# EAGLE schematic LoraGateway (EAGLE 9.2.2)

## Sheet 1 of 4: Power Supplies
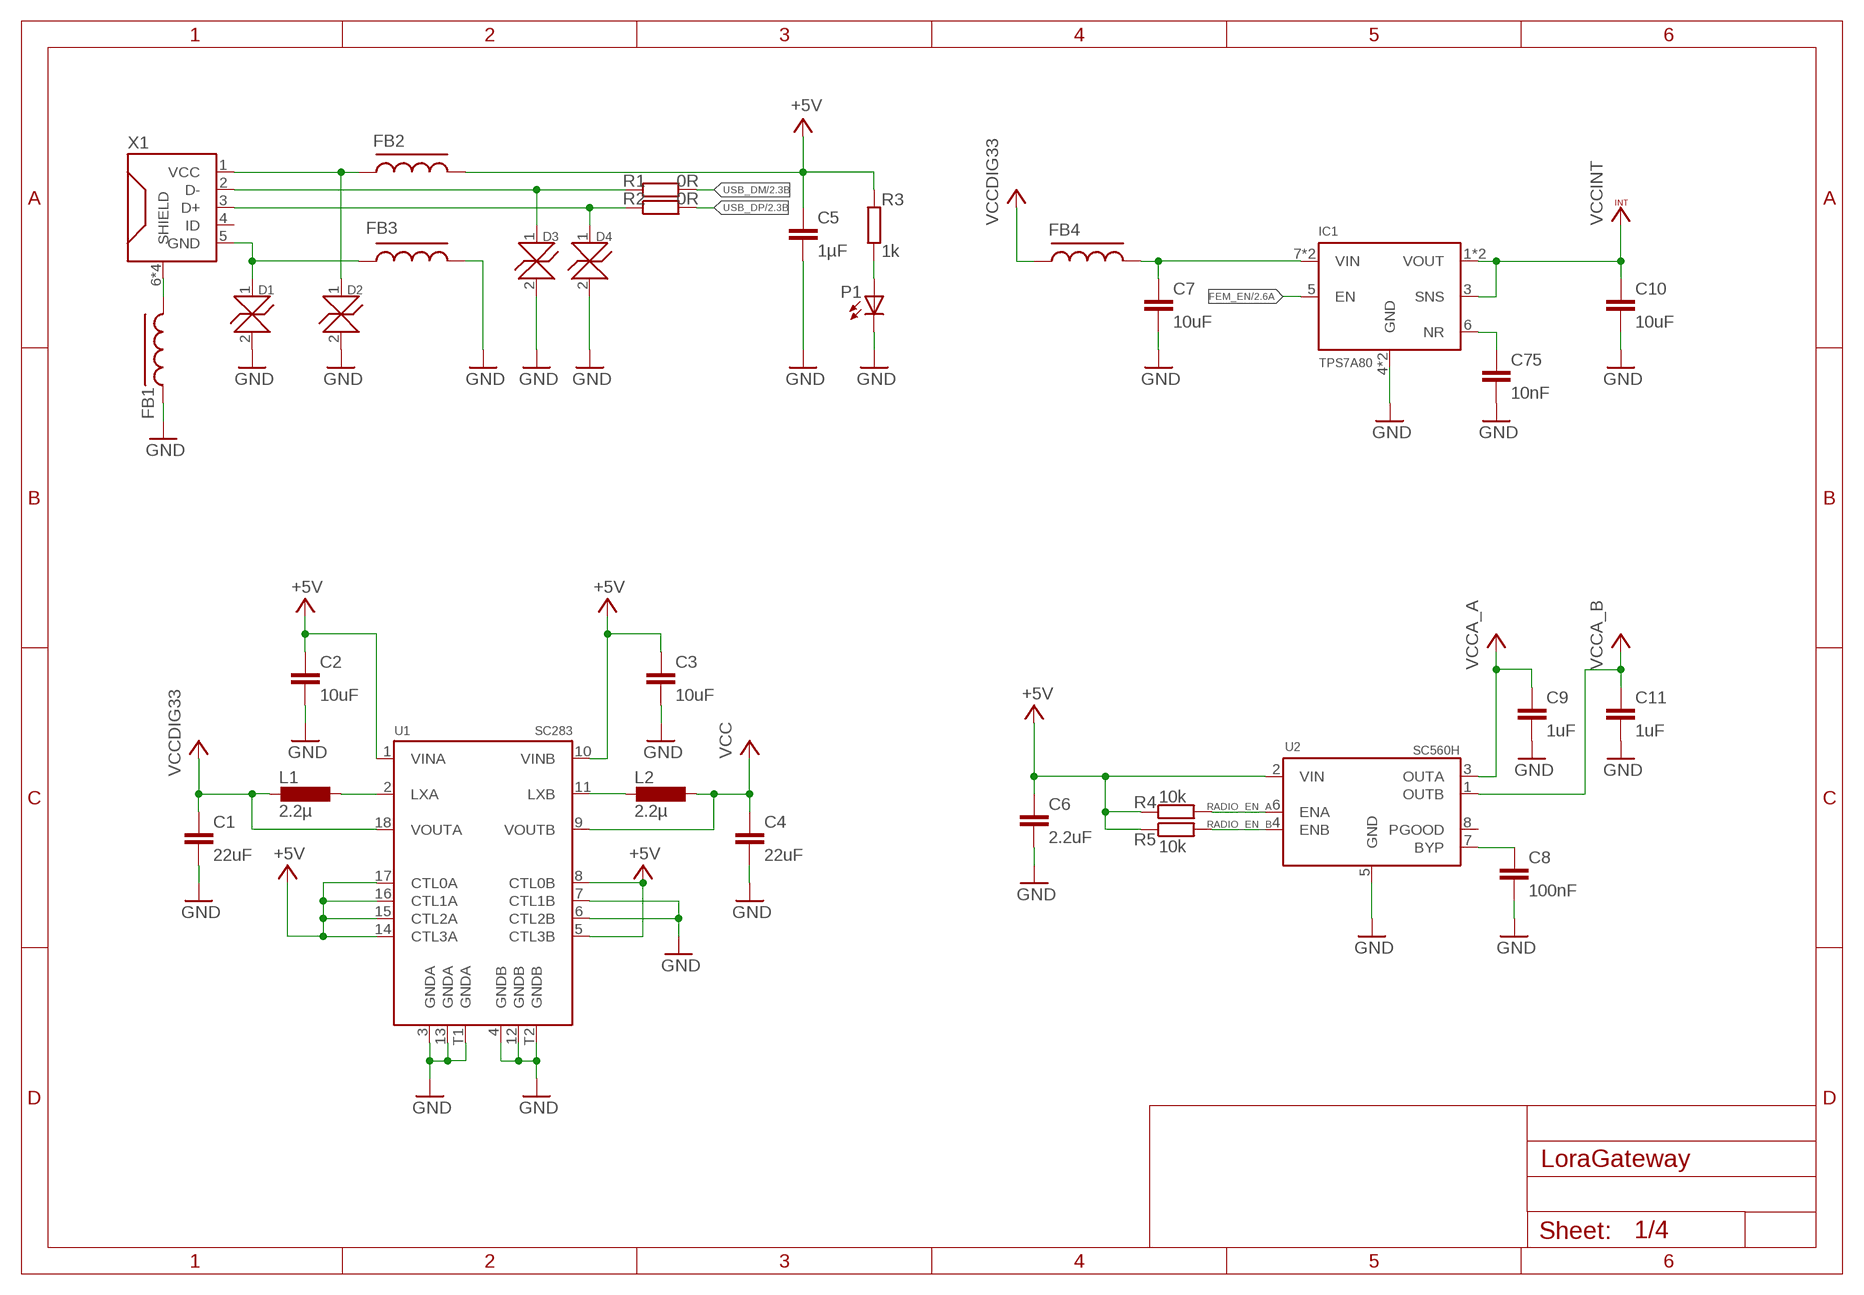
[diagram p0: schematic, sheet 1]

### Parts
C1  22uF  C-EUC1206  [C1206]
C2  10uF  C-EUC1206  [C1206]
C3  10uF  C-EUC1206  [C1206]
C4  22uF  C-EUC1206  [C1206]
C5  1µF  C-EUC0805  [C0805]
C6  2.2uF  C-EUC0603  [C0603]
C7  10uF  C-EUC0805  [C0805]
C8  100nF  C-EUC0402  [C0402]
C9  1uF  C-EUC0805  [C0805]
C10  10uF  C-EUC0805  [C0805]
C11  1uF  C-EUC0805  [C0805]
C75  10nF  C-EUC0402  [C0402]
D1  RCLAMP0531T  [SLP1006P2T]
D2  RCLAMP0531T  [SLP1006P2T]
D3  RCLAMP0531T  [SLP1006P2T]
D4  RCLAMP0531T  [SLP1006P2T]
FB1  BLM15PG100SN1D0402  [L0402]
FB2  BLM15PG100SN1D0402  [L0402]
FB3  BLM15PG100SN1D0402  [L0402]
FB4  BLM15PG100SN1D0402  [L0402]
IC1  TPS7A80  [SON-8]
L1  2.2µ  ASPI-0418  [ASPI-0418]
L2  2.2µ  ASPI-0418  [ASPI-0418]
P1  LTST-C191KGKT  [LED_SML0603]
R1  0R  R-EU_R0402  [R0402]
R2  0R  R-EU_R0402  [R0402]
R3  1k  R-EU_R0402  [R0402]
R4  10k  R-EU_R0402  [R0402]
R5  10k  R-EU_R0402  [R0402]
U1  SC283  [2X3MLPQ-W18]
U2  SC560H  [MLPQ-UT8]
X1  USB2-MICRO  [USB-2-MICRO]

### Nets
+5V: C2.1 C3.1 C5.2 C6.1 FB2.2 R3.2 R4.1 R5.1 U1.1(VINA) U1.5(CTL3B) U1.8(CTL0B) U1.10(VINB) U1.14(CTL3A) U1.15(CTL2A) U1.16(CTL1A) U1.17(CTL0A) U2.2(VIN) ; also sheet 2
D+: D4.1 R2.1 X1.3(D+)
D-: D3.1 R1.1 X1.2(D-)
FEM_EN: IC1.5(EN) ; also sheet 2,4
GND: C1.2 C2.2 C3.2 C4.2 C5.1 C6.2 C7.2 C8.2 C9.2 C10.2 C11.2 C75.2 D1.2 D2.2 D3.2 D4.2 FB1.1 FB3.2 IC1.4(GND) IC1.EXP(GND) P1.C U1.3(GNDA) U1.4(GNDB) U1.6(CTL2B) U1.7(CTL1B) U1.12(GNDB) U1.13(GNDA) U1.T1(GNDA) U1.T2(GNDB) U2.5(GND) ; also sheet 2,3,4
N$1: L1.1 U1.2(LXA)
N$2: L2.2 U1.11(LXB)
N$3: C75.1 IC1.6(NR)
N$4: C8.1 U2.7(BYP)
N$6: D1.1 FB3.1 X1.5(GND)
N$9: FB1.2 X1.6(SHIELD) X1.7(SHIELD) X1.8(SHIELD) X1.9(SHIELD)
N$10: P1.A R3.1
N$12: C7.1 FB4.2 IC1.7(VIN) IC1.8(VIN)
RADIO_EN_A: R4.2 U2.6(ENA) ; also sheet 2
RADIO_EN_B: R5.2 U2.4(ENB) ; also sheet 2
USB_DM: R1.2 ; also sheet 2
USB_DP: R2.2 ; also sheet 2
VBUS: D2.1 FB2.1 X1.1(VCC)
VCC: C4.1 L2.1 U1.9(VOUTB) ; also sheet 3
VCCA_A: C9.1 U2.3(OUTA) ; also sheet 4
VCCA_B: C11.1 U2.1(OUTB) ; also sheet 4
VCCDIG33: C1.1 FB4.1 L1.2 U1.18(VOUTA) ; also sheet 2,3
VCCINT: C10.1 IC1.1(VOUT) IC1.2(VOUT) IC1.3(SNS) ; also sheet 4
Unconnected: U2.8(PGOOD) X1.4(ID)

## Sheet 2 of 4: Microcontroller
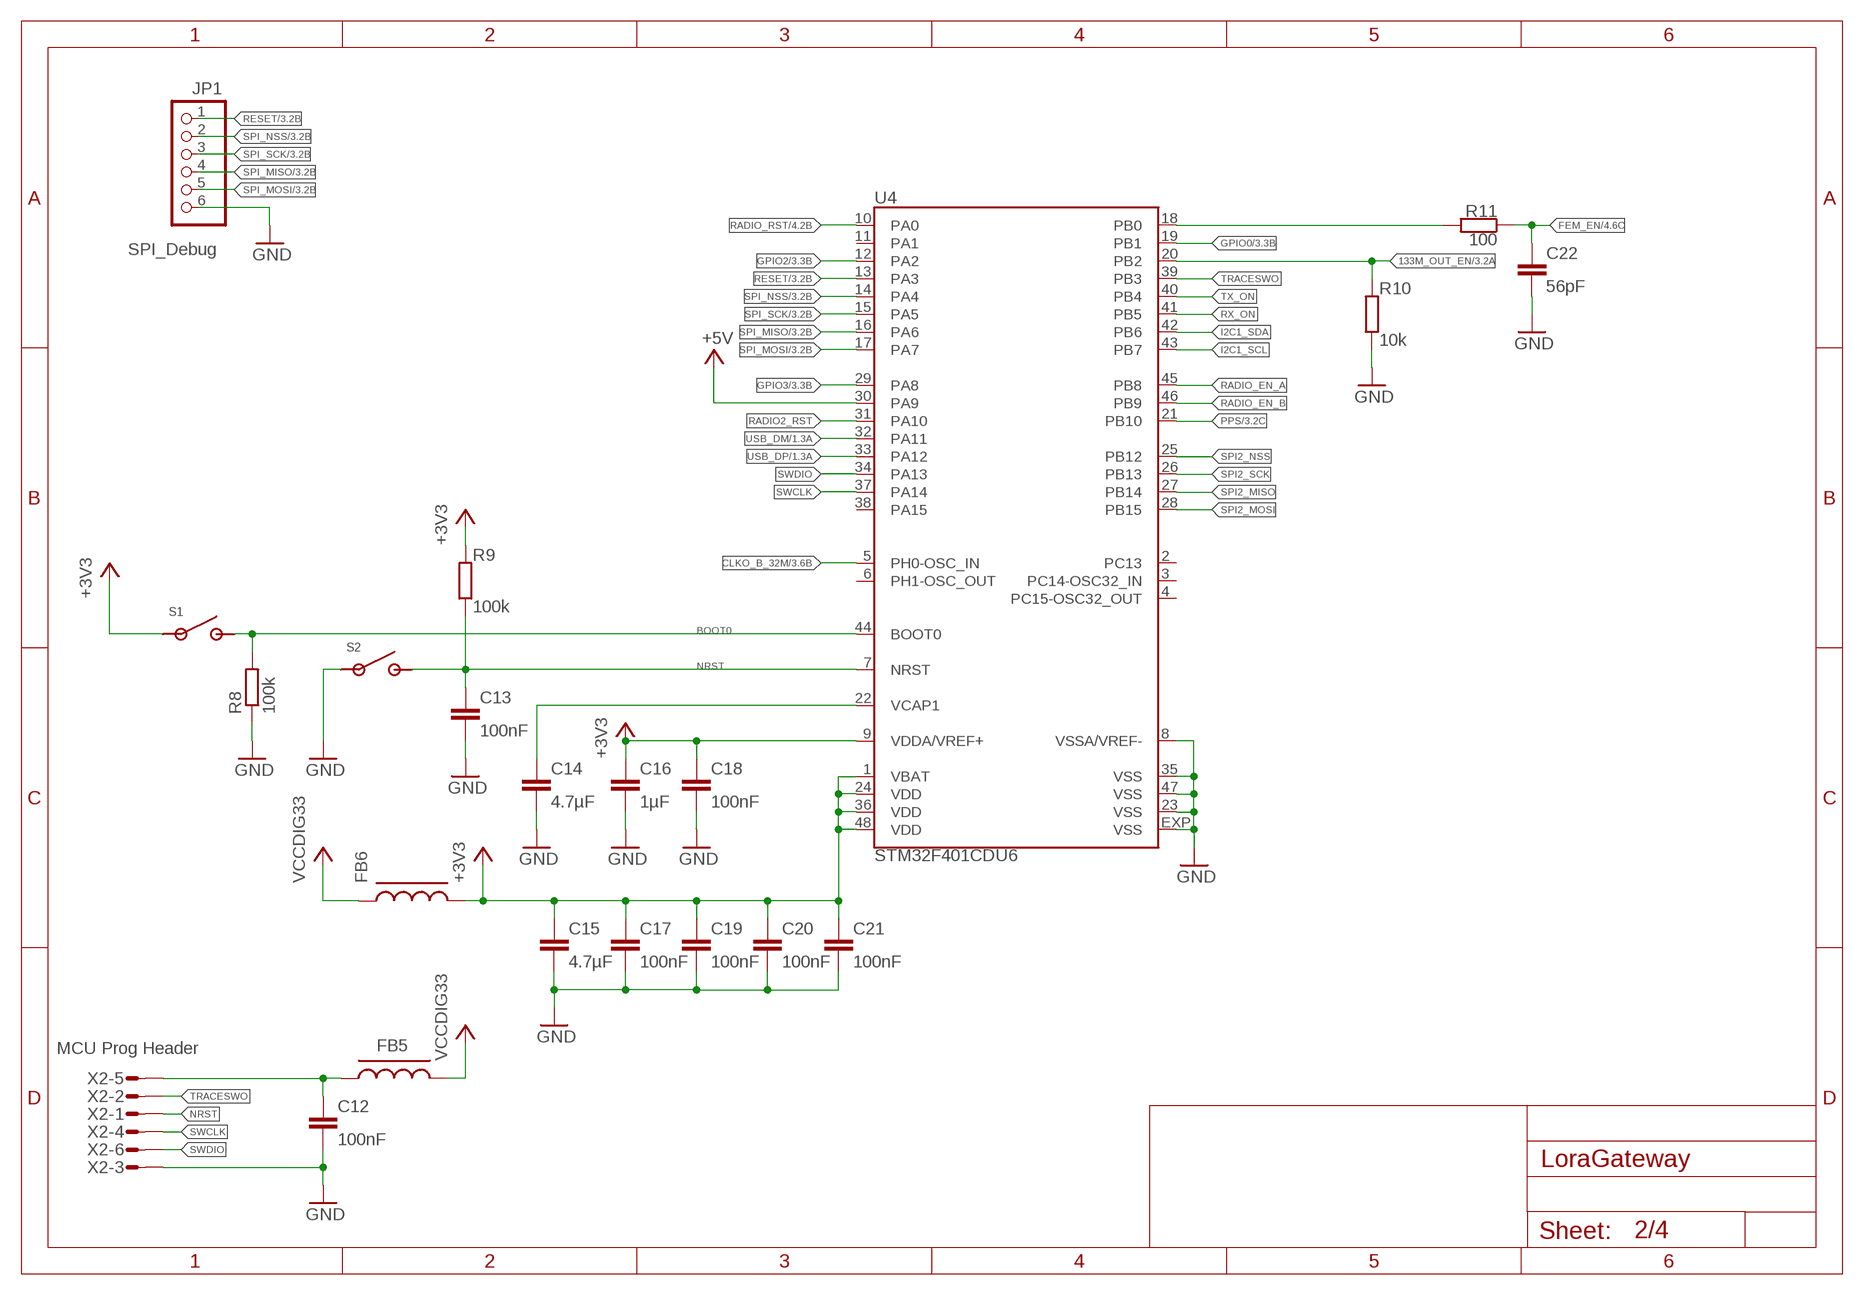
[diagram p1: schematic, sheet 2]

### Parts
C12  100nF  C-EUC0402  [C0402]
C13  100nF  C-EUC0402  [C0402]
C14  4.7µF  C-EUC0603  [C0603]
C15  4.7µF  C-EUC0603  [C0603]
C16  1µF  C-EUC0402  [C0402]
C17  100nF  C-EUC0402  [C0402]
C18  100nF  C-EUC0402  [C0402]
C19  100nF  C-EUC0402  [C0402]
C20  100nF  C-EUC0402  [C0402]
C21  100nF  C-EUC0402  [C0402]
C22  56pF  C-EUC0402  [C0402]
FB5  BLM15PG100SN1D0402  [L0402]
FB6  BLM15PG100SN1D0402  [L0402]
JP1  SPI_Debug  PINHD-1X6  [1X06]
R8  100k  R-EU_R0402  [R0402]
R9  100k  R-EU_R0402  [R0402]
R10  10k  R-EU_R0402  [R0402]
R11  100  R-EU_R0402  [R0402]
S1  KXT121LHS  [SMDSWITCH3.5X2.0MM]
S2  KXT121LHS  [SMDSWITCH3.5X2.0MM]
U4  STM32F401CDU6  [P-QFP48-7X7MM]
X2  MCU Prog Header  MICROMATCH-6  [MICROMATCH-6]

### Nets
133M_OUT_EN: R10.2 U4.20(PB2) ; also sheet 3
+3V3: C15.1 C16.1 C17.1 C18.1 C19.1 C20.1 C21.1 FB6.2 R9.2 S1.P$1 U4.1(VBAT) U4.9(VDDA/VREF+) U4.24(VDD) U4.36(VDD) U4.48(VDD)
+5V: U4.30(PA9) ; also sheet 1
BOOT0: R8.2 S1.P$2 U4.44(BOOT0)
CLKO_B_32M: U4.5(PH0-OSC_IN) ; also sheet 3
FEM_EN: C22.1 R11.1 ; also sheet 1,4
GND: C12.2 C13.2 C14.2 C15.2 C16.2 C17.2 C18.2 C19.2 C20.2 C21.2 C22.2 JP1.6 R8.1 R10.1 S2.P$1 U4.8(VSSA/VREF-) U4.23(VSS) U4.35(VSS) U4.47(VSS) U4.EXP(VSS) X2.3 ; also sheet 1,3,4
GPIO0: U4.19(PB1) ; also sheet 3
GPIO2: U4.12(PA2) ; also sheet 3
GPIO3: U4.29(PA8) ; also sheet 3
I2C1_SCL: U4.43(PB7)
I2C1_SDA: U4.42(PB6)
N$5: C12.1 FB5.1 X2.5
N$33: R11.2 U4.18(PB0)
NRST: C13.1 R9.1 S2.P$2 U4.7(NRST) X2.1
PPS: U4.21(PB10) ; also sheet 3
RADIO2_RST: U4.31(PA10)
RADIO_EN_A: U4.45(PB8) ; also sheet 1
RADIO_EN_B: U4.46(PB9) ; also sheet 1
RADIO_RST: U4.10(PA0) ; also sheet 4
RESET: JP1.1 U4.13(PA3) ; also sheet 3
RX_ON: U4.41(PB5) ; also sheet 3
SPI2_MISO: U4.27(PB14)
SPI2_MOSI: U4.28(PB15)
SPI2_NSS: U4.25(PB12)
SPI2_SCK: U4.26(PB13)
SPI_MISO: JP1.4 U4.16(PA6) ; also sheet 3
SPI_MOSI: JP1.5 U4.17(PA7) ; also sheet 3
SPI_NSS: JP1.2 U4.14(PA4) ; also sheet 3
SPI_SCK: JP1.3 U4.15(PA5) ; also sheet 3
SWCLK: U4.37(PA14) X2.4
SWDIO: U4.34(PA13) X2.6
TRACESWO: U4.39(PB3) X2.2
TX_ON: U4.40(PB4) ; also sheet 3
USB_DM: U4.32(PA11) ; also sheet 1
USB_DP: U4.33(PA12) ; also sheet 1
VCAP: C14.1 U4.22(VCAP1)
VCCDIG33: FB5.2 FB6.1 ; also sheet 1,3
Unconnected: U4.2(PC13) U4.3(PC14-OSC32_IN) U4.4(PC15-OSC32_OUT) U4.6(PH1-OSC_OUT) U4.11(PA1) U4.38(PA15)

## Sheet 3 of 4: Baseband
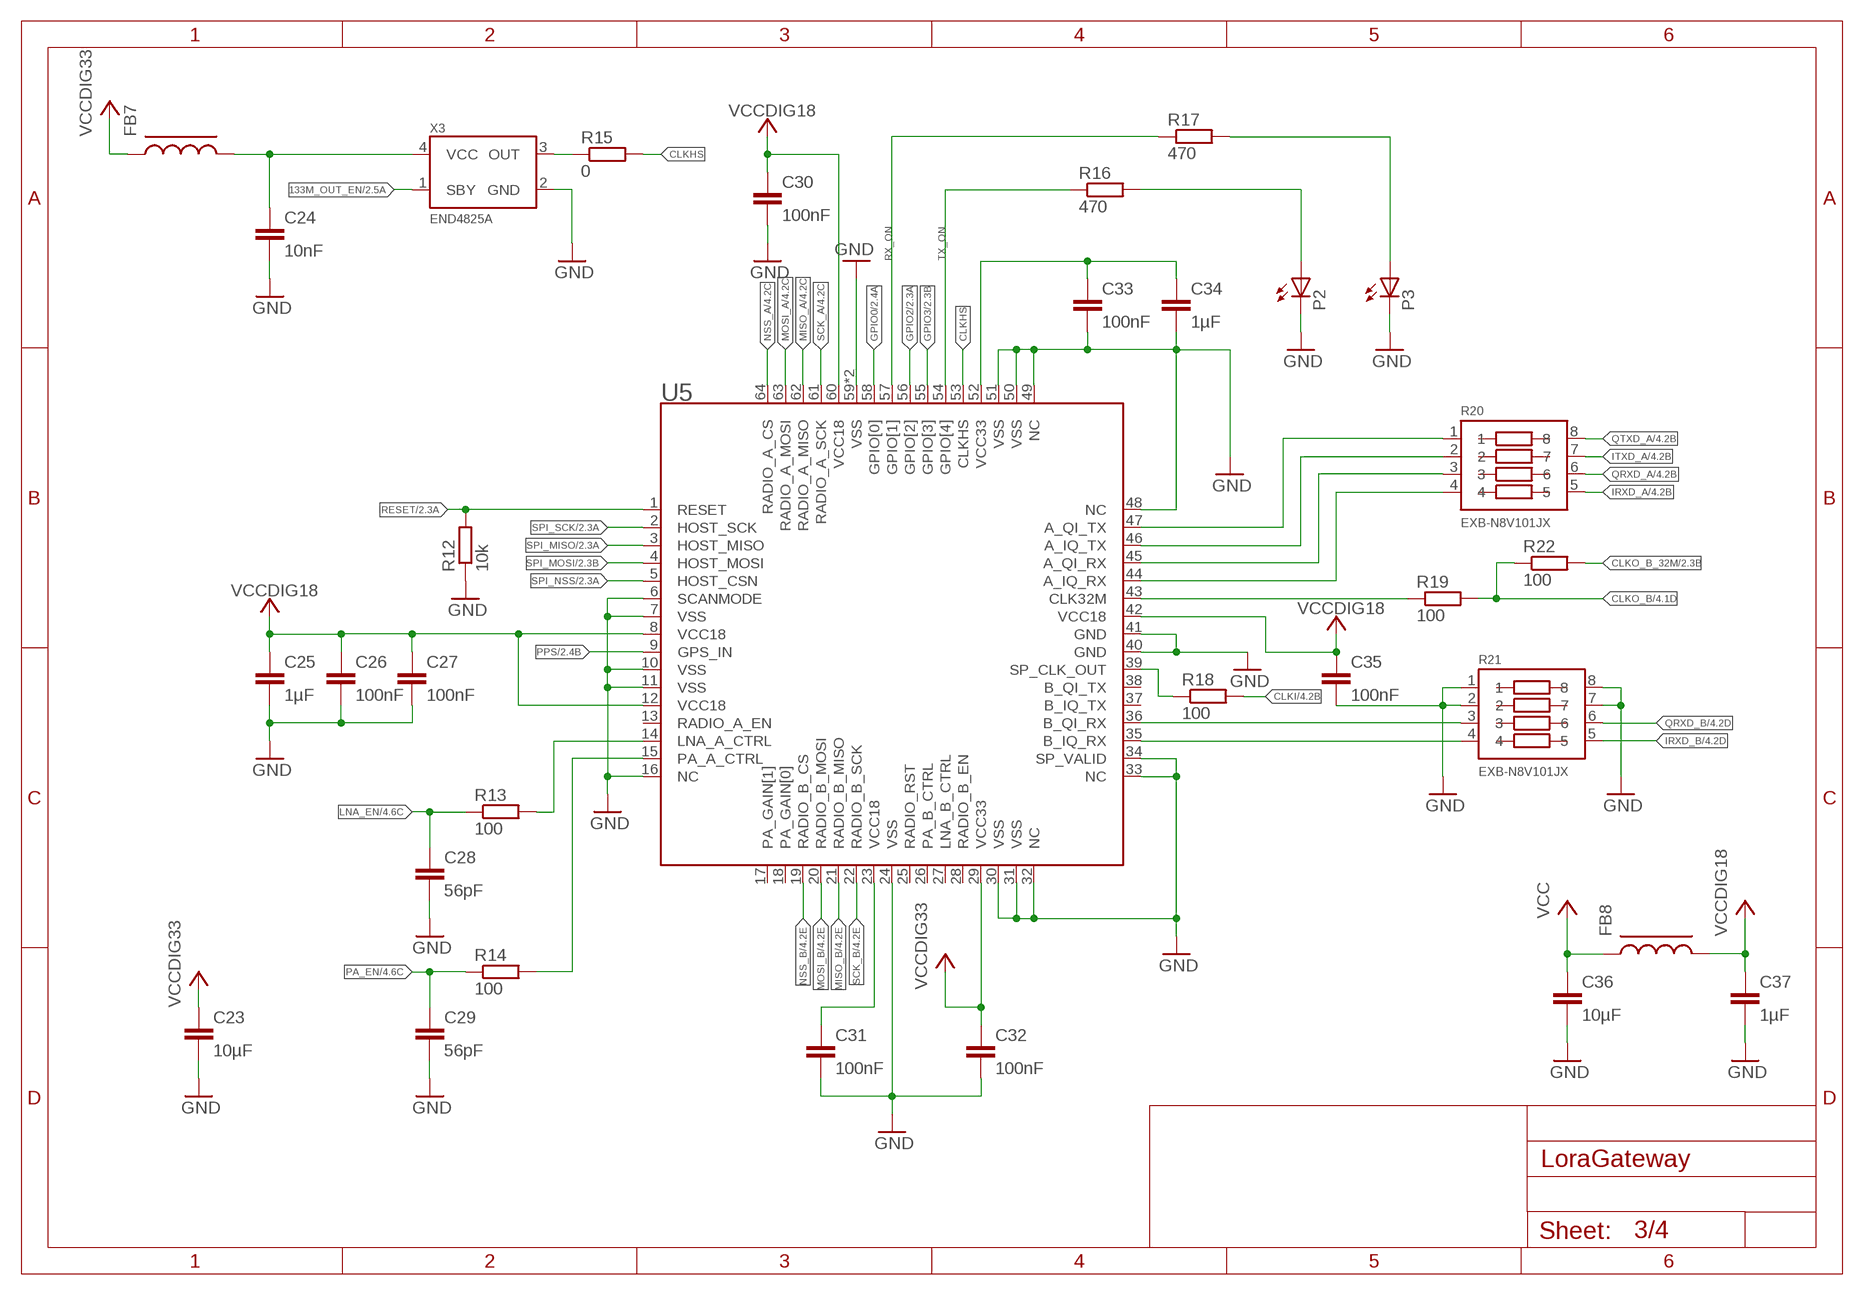
[diagram p2: schematic, sheet 3]

### Parts
C23  10µF  C-EUC0805  [C0805]
C24  10nF  C-EUC0402  [C0402]
C25  1µF  C-EUC0603  [C0603]
C26  100nF  C-EUC0402  [C0402]
C27  100nF  C-EUC0402  [C0402]
C28  56pF  C-EUC0402  [C0402]
C29  56pF  C-EUC0402  [C0402]
C30  100nF  C-EUC0402  [C0402]
C31  100nF  C-EUC0402  [C0402]
C32  100nF  C-EUC0402  [C0402]
C33  100nF  C-EUC0402  [C0402]
C34  1µF  C-EUC0603  [C0603]
C35  100nF  C-EUC0402  [C0402]
C36  10µF  C-EUC0805  [C0805]
C37  1µF  C-EUC0603  [C0603]
FB7  BLM15PG100SN1D0402  [L0402]
FB8  BLM15PG100SN1D0402  [L0402]
P2  LTST-C930KGKT  [LTST-C930KGKT]
P3  LTST-C930KGKT  [LTST-C930KGKT]
R12  10k  R-EU_R0402  [R0402]
R13  100  R-EU_R0402  [R0402]
R14  100  R-EU_R0402  [R0402]
R15  0  R-EU_R0402  [R0402]
R16  470  R-EU_R0402  [R0402]
R17  470  R-EU_R0402  [R0402]
R18  100  R-EU_R0402  [R0402]
R19  100  R-EU_R0402  [R0402]
R20  EXB-N8V101JX  [EXB28V]
R21  EXB-N8V101JX  [EXB28V]
R22  100  R-EU_R0402  [R0402]
U5  SX1308  [QFN64-9X9]
X3  END4825A  [2.5X2.0MM]

### Nets
133M_OUT_EN: X3.1(SBY) ; also sheet 2
CLKHS: R15.2 U5.53(CLKHS)
CLKI: R18.2 ; also sheet 4
CLKO_B: R19.2 R22.1 ; also sheet 4
CLKO_B_32M: R22.2 ; also sheet 2
GND: C23.2 C24.2 C25.2 C26.2 C27.2 C28.2 C29.2 C30.2 C31.2 C32.2 C33.2 C34.2 C35.2 C36.2 C37.2 P2.2(C) P3.2(C) R12.1 R21.1 R21.2 R21.7 R21.8 U5.6(SCANMODE) U5.7(VSS) U5.10(VSS) U5.11(VSS) U5.16(NC) U5.24(VSS) U5.30(VSS) U5.31(VSS) U5.32(NC) U5.33(NC) U5.34(SP_VALID) U5.40(GND) U5.41(GND) U5.48(NC) U5.49(NC) U5.50(VSS) U5.51(VSS) U5.59(VSS) U5.EXP(VSS) X3.2(GND) ; also sheet 1,2,4
GPIO0: U5.58(GPIO[0]) ; also sheet 2
GPIO2: U5.56(GPIO[2]) ; also sheet 2
GPIO3: U5.55(GPIO[3]) ; also sheet 2
IRXD_A: R20.5 ; also sheet 4
IRXD_B: R21.5 ; also sheet 4
ITXD_A: R20.7 ; also sheet 4
LNA_EN: C28.1 R13.1 ; also sheet 4
MISO_A: U5.62(RADIO_A_MISO) ; also sheet 4
MISO_B: U5.21(RADIO_B_MISO) ; also sheet 4
MOSI_A: U5.63(RADIO_A_MOSI) ; also sheet 4
MOSI_B: U5.20(RADIO_B_MOSI) ; also sheet 4
N$14: P2.1(A) R16.2
N$15: P3.1(A) R17.2
N$16: C24.1 FB7.2 X3.4(VCC)
N$17: R15.1 X3.3(OUT)
N$28: R13.2 U5.14(LNA_A_CTRL)
N$29: R14.2 U5.15(PA_A_CTRL)
N$38: C31.1 U5.23(VCC18)
N$45: R18.1 U5.39(SP_CLK_OUT)
N$50: R21.3 U5.36(B_QI_RX)
N$51: R21.4 U5.35(B_IQ_RX)
N$58: R19.1 U5.43(CLK32M)
N$59: R20.4 U5.44(A_IQ_RX)
N$60: R20.3 U5.45(A_QI_RX)
N$61: R20.2 U5.46(A_IQ_TX)
N$62: R20.1 U5.47(A_QI_TX)
N$67: C33.1 C34.1 U5.52(VCC33)
NSS_A: U5.64(RADIO_A_CS) ; also sheet 4
NSS_B: U5.19(RADIO_B_CS) ; also sheet 4
PA_EN: C29.1 R14.1 ; also sheet 4
PPS: U5.9(GPS_IN) ; also sheet 2
QRXD_A: R20.6 ; also sheet 4
QRXD_B: R21.6 ; also sheet 4
QTXD_A: R20.8 ; also sheet 4
RESET: R12.2 U5.1(RESET) ; also sheet 2
RX_ON: R17.1 U5.57(GPIO[1]) ; also sheet 2
SCK_A: U5.61(RADIO_A_SCK) ; also sheet 4
SCK_B: U5.22(RADIO_B_SCK) ; also sheet 4
SPI_MISO: U5.3(HOST_MISO) ; also sheet 2
SPI_MOSI: U5.4(HOST_MOSI) ; also sheet 2
SPI_NSS: U5.5(HOST_CSN) ; also sheet 2
SPI_SCK: U5.2(HOST_SCK) ; also sheet 2
TX_ON: R16.1 U5.54(GPIO[4]) ; also sheet 2
VCC: C36.1 FB8.1 ; also sheet 1
VCCDIG18: C25.1 C26.1 C27.1 C30.1 C35.1 C37.1 FB8.2 U5.8(VCC18) U5.12(VCC18) U5.42(VCC18) U5.60(VCC18)
VCCDIG33: C23.1 C32.1 FB7.1 U5.29(VCC33) ; also sheet 1,2
Unconnected: U5.13(RADIO_A_EN) U5.17(PA_GAIN[1]) U5.18(PA_GAIN[0]) U5.25(RADIO_RST) U5.26(PA_B_CTRL) U5.27(LNA_B_CTRL) U5.28(RADIO_B_EN) U5.37(B_IQ_TX) U5.38(B_QI_TX)

## Sheet 4 of 4: HF Frontends
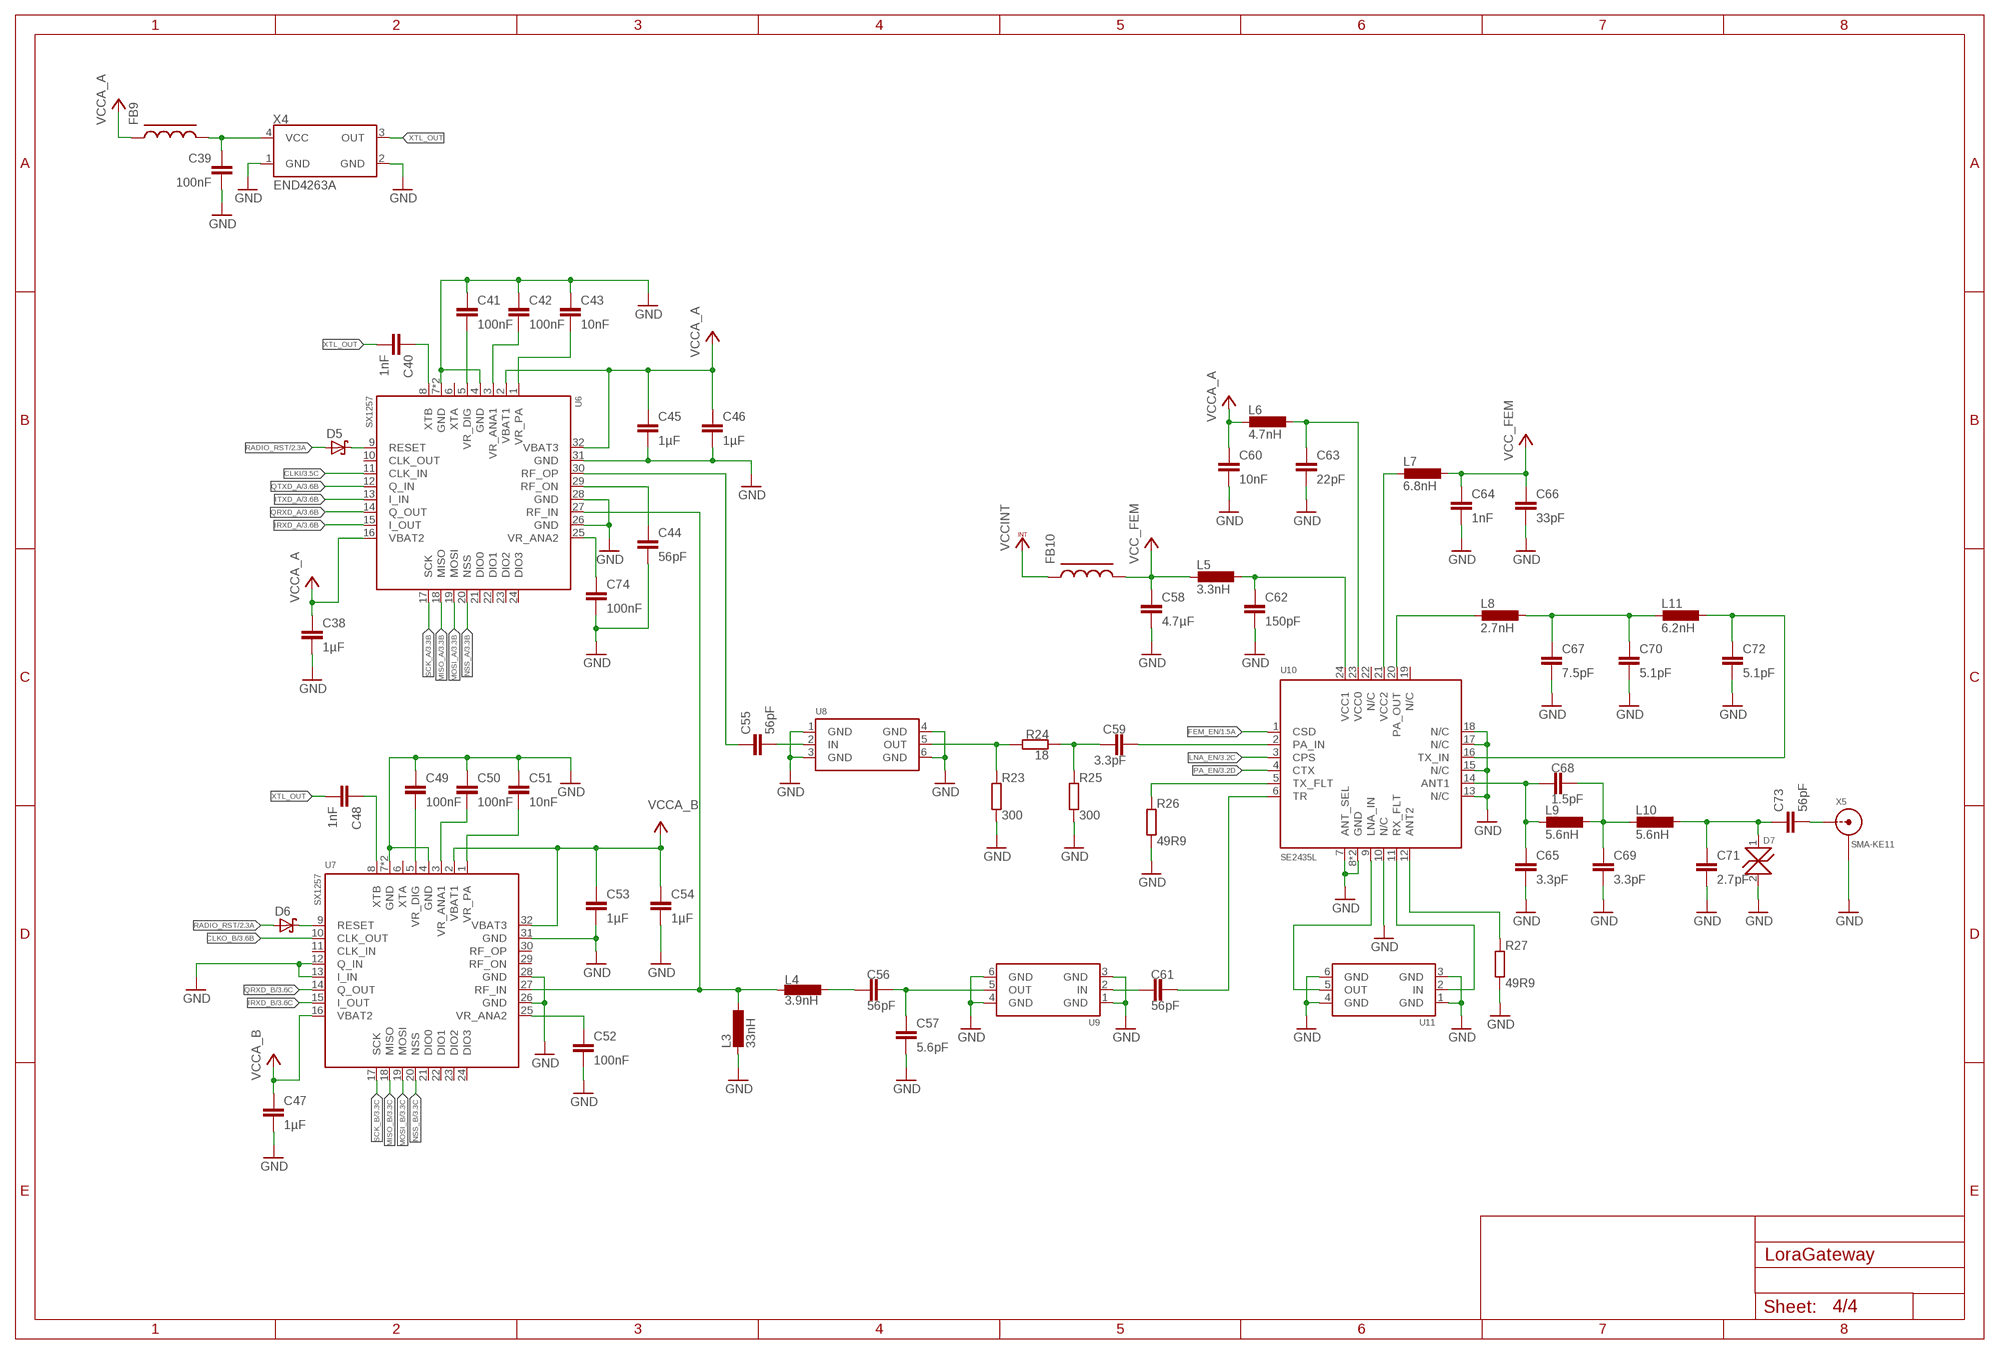
[diagram p3: schematic, sheet 4]

### Parts
C38  1µF  C-EUC0603  [C0603]
C39  100nF  C-EUC0402  [C0402]
C40  1nF  C-EUC0402  [C0402]
C41  100nF  C-EUC0402  [C0402]
C42  100nF  C-EUC0402  [C0402]
C43  10nF  C-EUC0402  [C0402]
C44  56pF  C-EUC0402  [C0402]
C45  1µF  C-EUC0603  [C0603]
C46  1µF  C-EUC0603  [C0603]
C47  1µF  C-EUC0603  [C0603]
C48  1nF  C-EUC0402  [C0402]
C49  100nF  C-EUC0402  [C0402]
C50  100nF  C-EUC0402  [C0402]
C51  10nF  C-EUC0402  [C0402]
C52  100nF  C-EUC0402  [C0402]
C53  1µF  C-EUC0603  [C0603]
C54  1µF  C-EUC0603  [C0603]
C55  56pF  C-EUC0402  [C0402]
C56  56pF  C-EUC0402  [C0402]
C57  5.6pF  C-EUC0402  [C0402]
C58  4.7µF  C-EUC0603  [C0603]
C59  3.3pF  C-EUC0402  [C0402]
C60  10nF  C-EUC0402  [C0402]
C61  56pF  C-EUC0402  [C0402]
C62  150pF  C-EUC0402  [C0402]
C63  22pF  C-EUC0402  [C0402]
C64  1nF  C-EUC0402  [C0402]
C65  3.3pF  C-EUC0402  [C0402]
C66  33pF  C-EUC0402  [C0402]
C67  7.5pF  C-EUC0402  [C0402]
C68  1.5pF  C-EUC0402  [C0402]
C69  3.3pF  C-EUC0402  [C0402]
C70  5.1pF  C-EUC0402  [C0402]
C71  2.7pF  C-EUC0402  [C0402]
C72  5.1pF  C-EUC0402  [C0402]
C73  56pF  C-EUC0402  [C0402]
C74  100nF  C-EUC0402  [C0402]
D5  BAT54XV2T1G  [SOD523]
D6  BAT54XV2T1G  [SOD523]
D7  LXES15AAA1-153  [LXES15AAA1-153]
FB9  BLM15PG100SN1D0402  [L0402]
FB10  BLM18PG121SH1D  [L0603]
L3  33nH  L-EU0402  [L0402]
L4  3.9nH  L-EU0402  [L0402]
L5  3.3nH  L-EU0402  [L0402]
L6  4.7nH  L-EU0402  [L0402]
L7  6.8nH  L-EU0402  [L0402]
L8  2.7nH  L-EU0402  [L0402]
L9  5.6nH  L-EU0402  [L0402]
L10  5.6nH  L-EU0402  [L0402]
L11  6.2nH  L-EU0402  [L0402]
R23  300  R-EU_R0402  [R0402]
R24  18  R-EU_R0402  [R0402]
R25  300  R-EU_R0402  [R0402]
R26  49R9  R-EU_R0402  [R0402]
R27  49R9  R-EU_R0402  [R0402]
U6  SX1257  [QFN32]
U7  SX1257  [QFN32]
U8  B39871B3717U410  [DCC6C-3X3]
U9  B39871B3717U410  [DCC6C-3X3]
U10  SE2435L  [VQFN24-4X4]
U11  B39871B3717U410  [DCC6C-3X3]
X4  END4263A  [2.0X1.6MM]
X5  SMA-KE11  [J502-ND-142-0711-871/876]

### Nets
CLKI: U6.11(CLK_IN) ; also sheet 3
CLKO_B: U7.10(CLK_OUT) ; also sheet 3
FEM_EN: U10.1(CSD) ; also sheet 1,2
GND: C38.2 C39.2 C41.1 C42.1 C43.1 C44.2 C45.2 C46.2 C47.2 C49.1 C50.1 C51.1 C52.2 C53.2 C54.2 C57.2 C58.2 C60.2 C62.2 C63.2 C64.2 C65.2 C66.2 C67.2 C69.2 C70.2 C71.2 C72.2 C74.2 D7.2 L3.2 R23.2 R25.2 R26.1 R27.1 U6.4(GND) U6.7(GND) U6.26(GND) U6.28(GND) U6.31(GND) U6.EXP(GND) U7.4(GND) U7.7(GND) U7.12(Q_IN) U7.13(I_IN) U7.26(GND) U7.28(GND) U7.31(GND) U7.EXP(GND) U8.1(GND) U8.3(GND) U8.4(GND) U8.6(GND) U9.1(GND) U9.3(GND) U9.4(GND) U9.6(GND) U10.7(ANT_SEL) U10.8(GND) U10.10(N/C) U10.13(N/C) U10.15(N/C) U10.17(N/C) U10.18(N/C) U10.GND U11.1(GND) U11.3(GND) U11.4(GND) U11.6(GND) X4.1(GND) X4.2(GND) X5.G@1(GND) X5.G@2(GND) X5.G@3(GND) X5.G@4(GND) ; also sheet 1,2,3
IRXD_A: U6.15(I_OUT) ; also sheet 3
IRXD_B: U7.15(I_OUT) ; also sheet 3
ITXD_A: U6.13(I_IN) ; also sheet 3
LNA_EN: U10.3(CPS) ; also sheet 3
MISO_A: U6.18(MISO) ; also sheet 3
MISO_B: U7.18(MISO) ; also sheet 3
MOSI_A: U6.19(MOSI) ; also sheet 3
MOSI_B: U7.19(MOSI) ; also sheet 3
N$13: C74.1 U6.25(VR_ANA2)
N$18: C39.1 FB9.2 X4.4(VCC)
N$19: R27.2 U10.12(ANT2)
N$20: U10.9(LNA_IN) U11.5(OUT)
N$21: U10.11(RX_FLT) U11.2(IN)
N$22: R26.2 U10.5(TX_FLT)
N$23: C63.1 L6.1 U10.23(VCC0)
N$24: C67.1 C70.1 L8.1 L11.2
N$25: C62.1 L5.1 U10.24(VCC1)
N$26: L7.2 U10.21(VCC2)
N$27: C68.2 C69.1 L9.1 L10.2
N$30: L8.2 U10.20(PA_OUT)
N$31: C72.1 L11.1 U10.16(TX_IN)
N$32: C65.1 C68.1 L9.2 U10.14(ANT1)
N$34: C71.1 C73.1 D7.1 L10.1
N$35: C59.1 U10.2(PA_IN)
N$36: C61.2 U10.6(TR)
N$37: C59.2 R24.1 R25.1
N$39: R23.1 R24.2 U8.5(OUT)
N$40: C55.2 U8.2(IN)
N$41: C61.1 U9.2(IN)
N$43: C56.2 C57.1 U9.5(OUT)
N$44: C56.1 L4.1
N$46: C55.1 U6.30(RF_OP)
N$47: C52.1 U7.25(VR_ANA2)
N$48: D6.C U7.9(RESET)
N$49: C48.1 U7.8(XTB)
N$52: C40.1 U6.8(XTB)
N$53: C43.2 U6.1(VR_PA)
N$54: C51.2 U7.1(VR_PA)
N$55: C50.2 U7.3(VR_ANA1)
N$56: C49.2 U7.5(VR_DIG)
N$57: C42.2 U6.3(VR_ANA1)
N$63: C41.2 U6.5(VR_DIG)
N$64: C44.1 U6.29(RF_ON)
N$65: C73.2 X5.1
N$70: D5.C U6.9(RESET)
NSS_A: U6.20(NSS) ; also sheet 3
NSS_B: U7.20(NSS) ; also sheet 3
PA_EN: U10.4(CTX) ; also sheet 3
QRXD_A: U6.14(Q_OUT) ; also sheet 3
QRXD_B: U7.14(Q_OUT) ; also sheet 3
QTXD_A: U6.12(Q_IN) ; also sheet 3
RADIO_RST: D5.A D6.A ; also sheet 2
RF_IN: L3.1 L4.2 U6.27(RF_IN) U7.27(RF_IN)
SCK_A: U6.17(SCK) ; also sheet 3
SCK_B: U7.17(SCK) ; also sheet 3
VCC_FEM: C58.1 C64.1 C66.1 FB10.2 L5.2 L7.1
VCCA_A: C38.1 C45.1 C46.1 C60.1 FB9.1 L6.2 U6.2(VBAT1) U6.16(VBAT2) U6.32(VBAT3) ; also sheet 1
VCCA_B: C47.1 C53.1 C54.1 U7.2(VBAT1) U7.16(VBAT2) U7.32(VBAT3) ; also sheet 1
VCCINT: FB10.1 ; also sheet 1
XTL_OUT: C40.2 C48.2 X4.3(OUT)
Unconnected: U6.6(XTA) U6.10(CLK_OUT) U6.21(DIO0) U6.22(DIO1) U6.23(DIO2) U6.24(DIO3) U7.6(XTA) U7.11(CLK_IN) U7.21(DIO0) U7.22(DIO1) U7.23(DIO2) U7.24(DIO3) U7.29(RF_ON) U7.30(RF_OP) U10.19(N/C) U10.22(N/C)

## Library data of the parts
C1 C4 = rcl:C-EU: CAPACITOR, European symbol; OC_DIGIKEY: 445-6001-1-ND; SPICEPREFIX: C
C2 C3 = rcl:C-EU: CAPACITOR, European symbol; OC_DIGIKEY: 490-5525-1-ND; SPICEPREFIX: C
C5 C9 C11 = rcl:C-EU: CAPACITOR, European symbol; OC_DIGIKEY: 490-1691-1-ND; SPICEPREFIX: C
C6 = rcl:C-EU: CAPACITOR, European symbol; OC_DIGIKEY: 1276-1878-1-ND; SPICEPREFIX: C
C7 C10 C23 C36 = rcl:C-EU: CAPACITOR, European symbol; OC_DIGIKEY: 1276-2399-1-ND; SPICEPREFIX: C
C8 C12 C13 C17-C21 C26 C27 C30-C33 C35 C39 C41 C42 C49 C50 C52 C74 = rcl:C-EU: CAPACITOR, European symbol; OC_DIGIKEY: 478-7888-1-ND; SPICEPREFIX: C
C14 C15 C58 = rcl:C-EU: CAPACITOR, European symbol; OC_DIGIKEY: 1276-1905-1-ND; SPICEPREFIX: C
C16 = rcl:C-EU: CAPACITOR, European symbol; OC_DIGIKEY: 478-4596-1-ND; SPICEPREFIX: C
C22 C28 C29 C44 C55 C56 C61 C73 = rcl:C-EU: CAPACITOR, European symbol; OC_DIGIKEY: 490-1288-1-ND; SPICEPREFIX: C
C24 C43 C51 C60 C75 = rcl:C-EU: CAPACITOR, European symbol; OC_DIGIKEY: 478-7867-1-ND; SPICEPREFIX: C
C25 C34 C37 C38 C45-C47 C53 C54 = rcl:C-EU: CAPACITOR, European symbol; OC_DIGIKEY: 490-1543-1-ND; SPICEPREFIX: C
C40 C48 C64 = rcl:C-EU: CAPACITOR, European symbol; OC_DIGIKEY: 490-6348-1-ND; SPICEPREFIX: C
C57 = rcl:C-EU: CAPACITOR, European symbol; OC_DIGIKEY: 490-6250-1-ND; SPICEPREFIX: C
C59 C65 C69 = rcl:C-EU: CAPACITOR, European symbol; OC_DIGIKEY: 490-6238-1-ND; SPICEPREFIX: C
C62 = rcl:C-EU: CAPACITOR, European symbol; OC_DIGIKEY: 311-1025-1-ND; SPICEPREFIX: C
C63 = rcl:C-EU: CAPACITOR, European symbol; OC_DIGIKEY: 490-11382-1-ND; SPICEPREFIX: C
C66 = rcl:C-EU: CAPACITOR, European symbol; OC_DIGIKEY: 490-5936-1-ND; SPICEPREFIX: C
C67 = rcl:C-EU: CAPACITOR, European symbol; OC_DIGIKEY: 490-8227-1-ND; SPICEPREFIX: C
C68 = rcl:C-EU: CAPACITOR, European symbol; OC_DIGIKEY: 490-6212-1-ND; SPICEPREFIX: C
C70 C72 = rcl:C-EU: CAPACITOR, European symbol; OC_DIGIKEY: 490-8215-1-ND; SPICEPREFIX: C
C71 = rcl:C-EU: CAPACITOR, European symbol; OC_DIGIKEY: 490-6229-1-ND; SPICEPREFIX: C
D1-D4 = LoRa Gateway:RCLAMP0531T; OC_DIGIKEY: RCLAMP0531TTCTCT-ND
D5 D6 = LoRa Gateway:BAT54XV2T1G; OC_DIGIKEY: BAT54XV2T1GOSCT-ND
D7 = LoRa Gateway:LXES15AAA1-153; OC_DIGIKEY: 490-13210-1-ND
FB1-FB9 = LoRa Gateway:BLM15PG100SN1D; OC_DIGIKEY: 490-5976-1-ND
FB10 = LoRa Gateway:BLM18PG121SH1D; OC_DIGIKEY: 490-7815-1-ND
IC1 = LoRa Gateway:TPS7A80; OC_DIGIKEY: 296-48375-1-ND
JP1 = pinhead:PINHD-1X6: PIN HEADER
L1 L2 = LoRa Gateway:ASPI-0418; OC_DIGIKEY: 535-10759-1-ND
L3 = LoRa Gateway:L-EU; OC_DIGIKEY: 490-1152-1-ND
L4 = LoRa Gateway:L-EU; OC_DIGIKEY: 490-6815-1-ND
L5 = LoRa Gateway:L-EU; OC_DIGIKEY: 490-6809-1-ND
L6 = LoRa Gateway:L-EU; OC_DIGIKEY: 490-1139-1-ND
L7 = LoRa Gateway:L-EU; OC_DIGIKEY: 490-1142-1-ND
L8 = LoRa Gateway:L-EU; OC_DIGIKEY: 490-1137-1-ND
L9 L10 = LoRa Gateway:L-EU; OC_DIGIKEY: 490-6834-1-ND
L11 = LoRa Gateway:L-EU; OC_DIGIKEY: 490-1141-1-ND
P1 = LoRa Gateway:LTST-C191KGKT; OC_DIGIKEY: 160-1446-1-ND
P2 P3 = LoRa Gateway:LTST-C930KGKT; OC_DIGIKEY: 160-1463-1-ND
R1 R2 R15 = rcl:R-EU_: RESISTOR, European symbol; OC_DIGIKEY: 541-4062-1-ND; SPICEPREFIX: R
R3 = rcl:R-EU_: RESISTOR, European symbol; OC_DIGIKEY: 541-1.0KJCT-ND; SPICEPREFIX: R
R4 R10 R12 = rcl:R-EU_: RESISTOR, European symbol; OC_DIGIKEY: 541-10KJCT-ND; SPICEPREFIX: R
R5 R8 R9 = rcl:R-EU_: RESISTOR, European symbol; OC_DIGIKEY: 311-100KJRCT-ND; SPICEPREFIX: R
R11 R13 R14 R18 R19 R22 = rcl:R-EU_: RESISTOR, European symbol; OC_DIGIKEY: 541-100ATCT-ND; SPICEPREFIX: R
R16 R17 = rcl:R-EU_: RESISTOR, European symbol; OC_DIGIKEY: 311-470JRCT-ND; SPICEPREFIX: R
R20 R21 = LoRa Gateway:EXB-N8V101JX; OC_DIGIKEY: Y10101CT-ND
R23 R25 = rcl:R-EU_: RESISTOR, European symbol; OC_DIGIKEY: RMCF0402FT300RCT-ND; SPICEPREFIX: R
R24 = rcl:R-EU_: RESISTOR, European symbol; OC_DIGIKEY: A129606CT-ND; SPICEPREFIX: R
R26 R27 = rcl:R-EU_: RESISTOR, European symbol; OC_DIGIKEY: 541-3967-1-ND; SPICEPREFIX: R
S1 S2 = LoRa Gateway:KXT121LHS; OC_DIGIKEY: CKN10778CT-ND
U1 = LoRa Gateway:SC283; OC_DIGIKEY: SC283WLCT-ND
U2 = LoRa Gateway:SC560H; OC_DIGIKEY: SC560HULCT-ND
U4 = LoRa Gateway:STM32F401CDU6; OC_DIGIKEY: 497-17427-ND
U5 = LoRa Gateway:SX1308; OC_DIGIKEY: SX1308IMLTRTCT-ND
U6 U7 = LoRa Gateway:SX1257; OC_DIGIKEY: SX1257IWLTRTCT-ND
U8 U9 U11 = LoRa Gateway:B39871B3717U410; OC_DIGIKEY: 495-3734-1-ND
U10 = LoRa Gateway:SE2435L; OC_DIGIKEY: 863-1349-1-ND
X1 = LoRa Gateway:USB2-MICRO: 10104110-0001LF - USB-Steckverbinder, Micro-USB Typ B, USB 2.0, Buchse, 5 -polig, Oberflächenmontage, Rechtwinklig; OC_DIGIKEY: 609-4052-1-ND
X2 = con-amp-micromatch:MICROMATCH-6: MicroMaTch 6 7-215464-6 / 0-215464-6 Drawing Number C-215464 DDEController.pdf; DIGIKEY: A99463TR-ND; MPN: 7-215464-6; OC_DIGIKEY: A30729TR-ND; OC_FARNELL: 3784630; OC_NEWARK: 19R8125
X3 = LoRa Gateway:END4825A; OC_DIGIKEY: 644-1329-1-ND
X4 = LoRa Gateway:END4263A; OC_DIGIKEY: 644-1328-1-ND
X5 = LoRa Gateway:SMA-KE11; OC_DIGIKEY: 931-1175-ND

## Net classes
0 default: width 0.2 mm